# EAGLE design kitt (EAGLE 5.02)
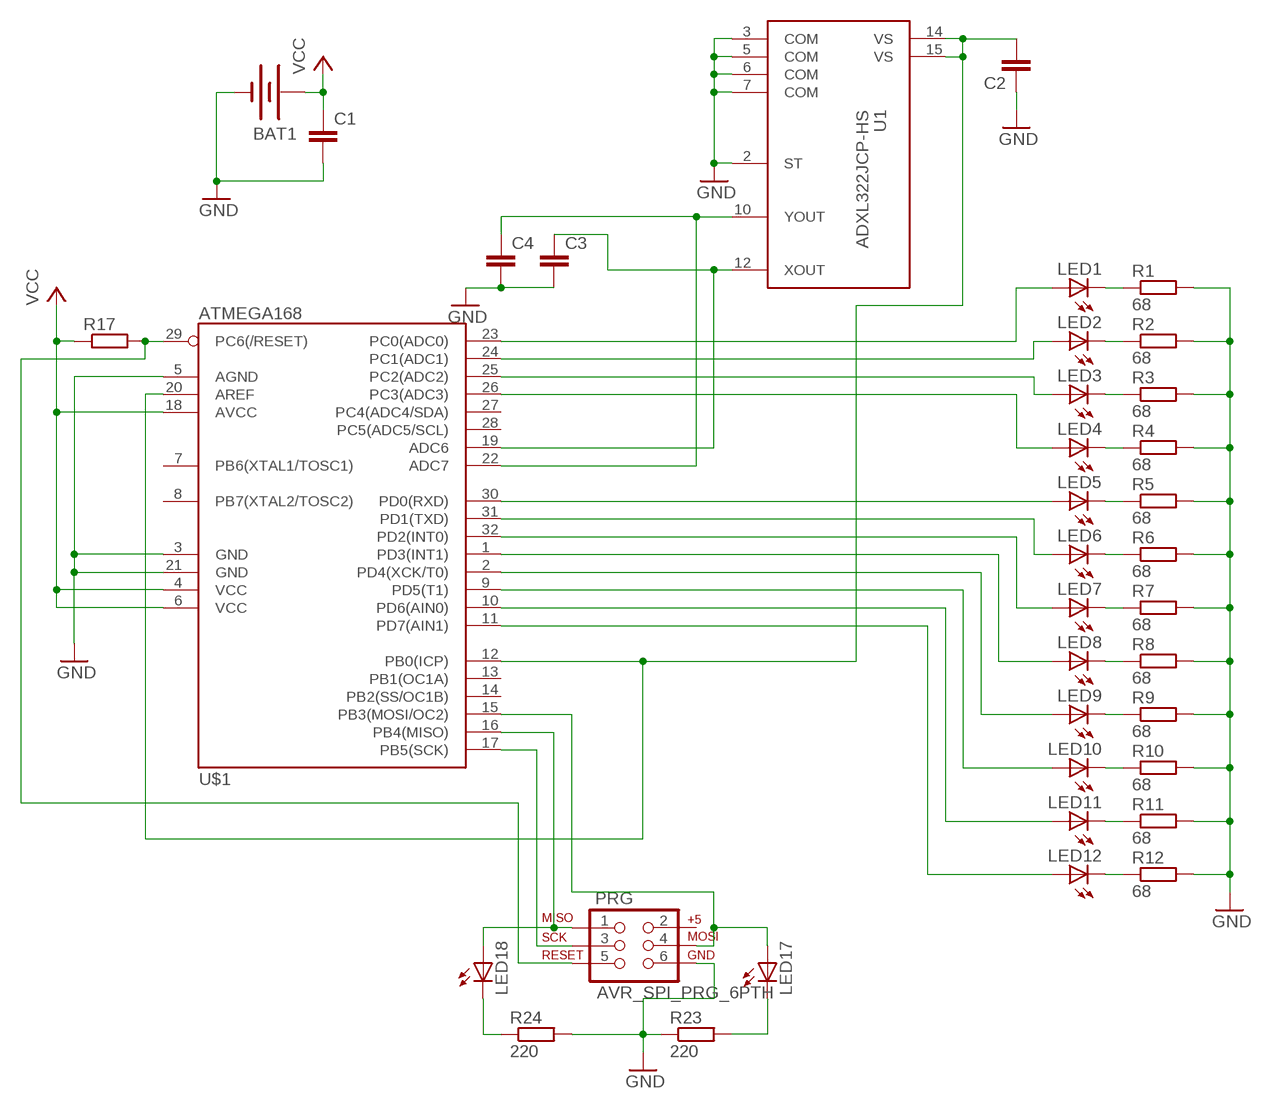
[diagram p0: schematic, sheet 1]

## Parts
BAT1  BATTERY20PTH  [BATTCOM_20MM_PTH]
C1  C-EUC0805  [C0805]
C2  C-EUC0805  [C0805]
C3  C-EUC0805  [C0805]
C4  C-EUC0805  [C0805]
LED1  LEDMICRO-SIDELED  [MICRO-SIDELED]
LED2  LEDMICRO-SIDELED  [MICRO-SIDELED]
LED3  LEDMICRO-SIDELED  [MICRO-SIDELED]
LED4  LEDMICRO-SIDELED  [MICRO-SIDELED]
LED5  LEDMICRO-SIDELED  [MICRO-SIDELED]
LED6  LEDMICRO-SIDELED  [MICRO-SIDELED]
LED7  LEDMICRO-SIDELED  [MICRO-SIDELED]
LED8  LEDMICRO-SIDELED  [MICRO-SIDELED]
LED9  LEDMICRO-SIDELED  [MICRO-SIDELED]
LED10  LEDMICRO-SIDELED  [MICRO-SIDELED]
LED11  LEDMICRO-SIDELED  [MICRO-SIDELED]
LED12  LEDMICRO-SIDELED  [MICRO-SIDELED]
LED17  LEDCHIP-LED0805  [CHIP-LED0805]
LED18  LEDCHIP-LED0805  [CHIP-LED0805]
PRG  AVR_SPI_PRG_6PTH  [2X3]
R1  68  R-EU_M0805  [M0805]
R2  68  R-EU_M0805  [M0805]
R3  68  R-EU_M0805  [M0805]
R4  68  R-EU_M0805  [M0805]
R5  68  R-EU_M0805  [M0805]
R6  68  R-EU_M0805  [M0805]
R7  68  R-EU_M0805  [M0805]
R8  68  R-EU_M0805  [M0805]
R9  68  R-EU_M0805  [M0805]
R10  68  R-EU_M0805  [M0805]
R11  68  R-EU_M0805  [M0805]
R12  68  R-EU_M0805  [M0805]
R17  R-EU_M0805  [M0805]
R23  220  R-EU_M0805  [M0805]
R24  220  R-EU_M0805  [M0805]
U1  ADXL322JCP-HS  [LFCSP16-HS]
U$1  ATMEGA168  [TQFP32-08]

## Nets
GND: BAT1.2(-) C1.2 C2.1 C3.2 C4.2 PRG.6 R1.2 R2.2 R3.2 R4.2 R5.2 R6.2 R7.2 R8.2 R9.2 R10.2 R11.2 R12.2 R23.1 R24.2 U1.2(ST) U1.3(COM) U1.5(COM) U1.6(COM) U1.7(COM) U$1.3(GND) U$1.5(AGND) U$1.21(GND)
N$1: LED5.A U$1.30(PD0(RXD))
N$2: LED1.C R1.1
N$3: LED2.A U$1.24(PC1(ADC1))
N$4: LED3.A U$1.25(PC2(ADC2))
N$5: LED1.A U$1.23(PC0(ADC0))
N$6: LED4.A U$1.26(PC3(ADC3))
N$7: LED6.A U$1.31(PD1(TXD))
N$8: LED7.A U$1.32(PD2(INT0))
N$9: LED8.A U$1.1(PD3(INT1))
N$10: LED9.A U$1.2(PD4(XCK/T0))
N$11: LED10.A U$1.9(PD5(T1))
N$12: LED11.A U$1.10(PD6(AIN0))
N$13: LED12.A U$1.11(PD7(AIN1))
N$14: C3.1 U1.12(XOUT) U$1.19(ADC6)
N$15: C4.1 U1.10(YOUT) U$1.22(ADC7)
N$17: C2.2 U1.14(VS) U1.15(VS) U$1.12(PB0(ICP)) U$1.20(AREF)
N$18: LED2.C R2.1
N$19: LED3.C R3.1
N$20: LED4.C R4.1
N$25: LED5.C R5.1
N$26: LED6.C R6.1
N$27: LED7.C R7.1
N$28: LED8.C R8.1
N$29: LED9.C R9.1
N$30: LED10.C R10.1
N$31: LED11.C R11.1
N$32: LED12.C R12.1
N$37: PRG.5 R17.2 U$1.29(PC6(/RESET))
N$45: LED18.A PRG.1 U$1.16(PB4(MISO))
N$46: PRG.3 U$1.17(PB5(SCK))
N$47: LED17.A PRG.4 U$1.15(PB3(MOSI/OC2))
N$48: LED18.C R24.1
N$51: LED17.C R23.2
VCC: BAT1.1(+) C1.1 R17.1 U$1.4(VCC) U$1.6(VCC) U$1.18(AVCC)
Unconnected: PRG.2 U1.1(NC) U1.4(NC) U1.8(NC) U1.9(NC) U1.11(NC) U1.13(NC) U1.16(NC) U$1.7(PB6(XTAL1/TOSC1)) U$1.8(PB7(XTAL2/TOSC2)) U$1.13(PB1(OC1A)) U$1.14(PB2(SS/OC1B)) U$1.27(PC4(ADC4/SDA)) U$1.28(PC5(ADC5/SCL))

## Library data of the parts
BAT1 = SparkFun:BATTERY: Battery Holders Various common sizes : AA, AAA, 20mm coin cell and 12mm coin cell.
C1-C4 = rcl:C-EU: CAPACITOR, European symbol
LED1-LED12 LED17 LED18 = led:LED: LED OSRAM: - CHIPLED LG R971, LG N971, LY N971, LG Q971, LY Q971, LO R971, LY R971 LH N974, LH R974 LS Q976, LO Q976, LY Q976 LO Q996 - Hyper CHIPLED LW Q18S LB Q993, LB Q99A, LB R99A - SideLED LS A670, LO A670, LY A670, LG A670, LP A670 LB A673, LV A673, LT A673, LW A673 LH A674 LY A675 LS A676, LA A676, LO A676, LY A676, LW A676 LS A679, LY A679, LG A679 - Hyper Micro SIDELED® LS Y876, LA Y876, LO Y876, LY Y876 LT Y87S - SmartLED LW L88C, LW L88S LB L89C, LB L89S, LG L890 LS L89K, LO L89K, LY L89K LS L896, LA L896, LO L896, LY L896 - TOPLED LS T670, LO T670, LY T670, LG T670, LP T670 LSG T670, LSP T670, LSY T670, LOP T670, LYG T670 LG T671, LOG T671, LSG T671 LB T673, LV T673, LT T673, LW T673 LH T674 LS T676, LA T676, LO T676, LY T676, LB T676, LH T676, LSB T676, LW T676 LB T67C, LV T67C, LT T67C, LS T67K, LO T67K, LY T67K, LW E67C LS E67B, LA E67B, LO E67B, LY E67B, LB E67C, LV E67C, LT E67C LW T67C LS T679, LY T679, LG T679 LS T770, LO T770, LY T770, LG T770, LP T770 LB T773, LV T773, LT T773, LW T773 LH T774 LS E675, LA E675, LY E675, LS T675 LS T776, LA T776, LO T776, LY T776, LB T776 LHGB T686 LT T68C, LB T68C - Hyper Mini TOPLED® LB M676 - Mini TOPLED Santana® LG M470 LS M47K, LO M47K, LY M47K Source: http://www.osram.convergy.de - LUMILED® LXK2-PW12-R00, LXK2-PW12-S00, LXK2-PW14-U00, LXK2-PW14-V00 LXK2-PM12-R00, LXK2-PM12-S00, LXK2-PM14-U00 LXK2-PE12-Q00, LXK2-PE12-R00, LXK2-PE12-S00, LXK2-PE14-T00, LXK2-PE14-U00 LXK2-PB12-K00, LXK2-PB12-L00, LXK2-PB12-M00, LXK2-PB14-N00, LXK2-PB14-P00, LXK2-PB14-Q00 LXK2-PR12-L00, LXK2-PR12-M00, LXK2-PR14-Q00, LXK2-PR14-R00 LXK2-PD12-Q00, LXK2-PD12-R00, LXK2-PD12-S00 LXK2-PH12-R00, LXK2-PH12-S00 LXK2-PL12-P00, LXK2-PL12-Q00, LXK2-PL12-R00 Source: www.luxeon.com
PRG = SparkFun:AVR_SPI_PRG_6: AVR ISP 6 Pin This is the reduced ISP connector for AVR programming. Common on Arduino. This footprint will take up less PCB space and can be used with a 10-pin to 6-pin adapter such as SKU: BOB-08508
R1-R12 R17 R23 R24 = rcl:R-EU_: RESISTOR, European symbol
U1 = adxl:ADXL322
U$1 = SparkFun:ATMEGA168

## Board
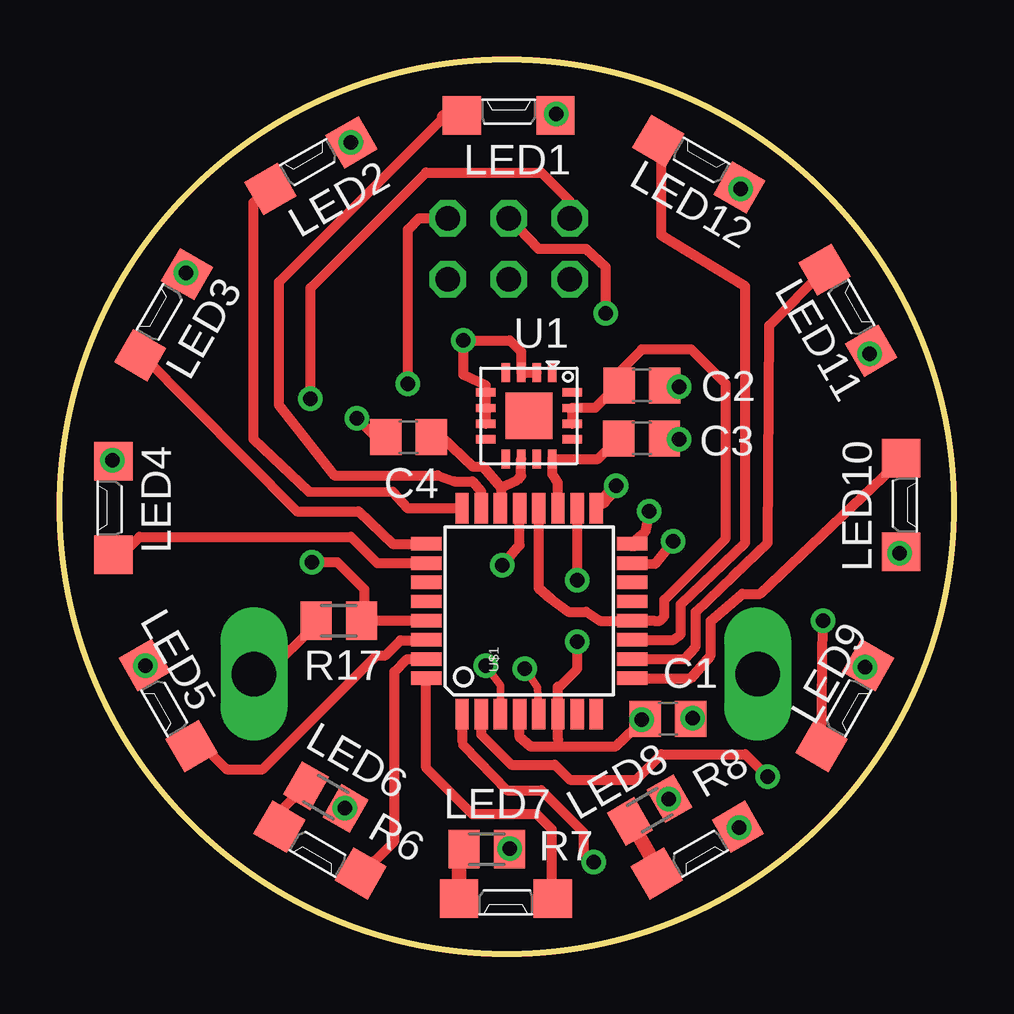
[diagram p1: board, top side]
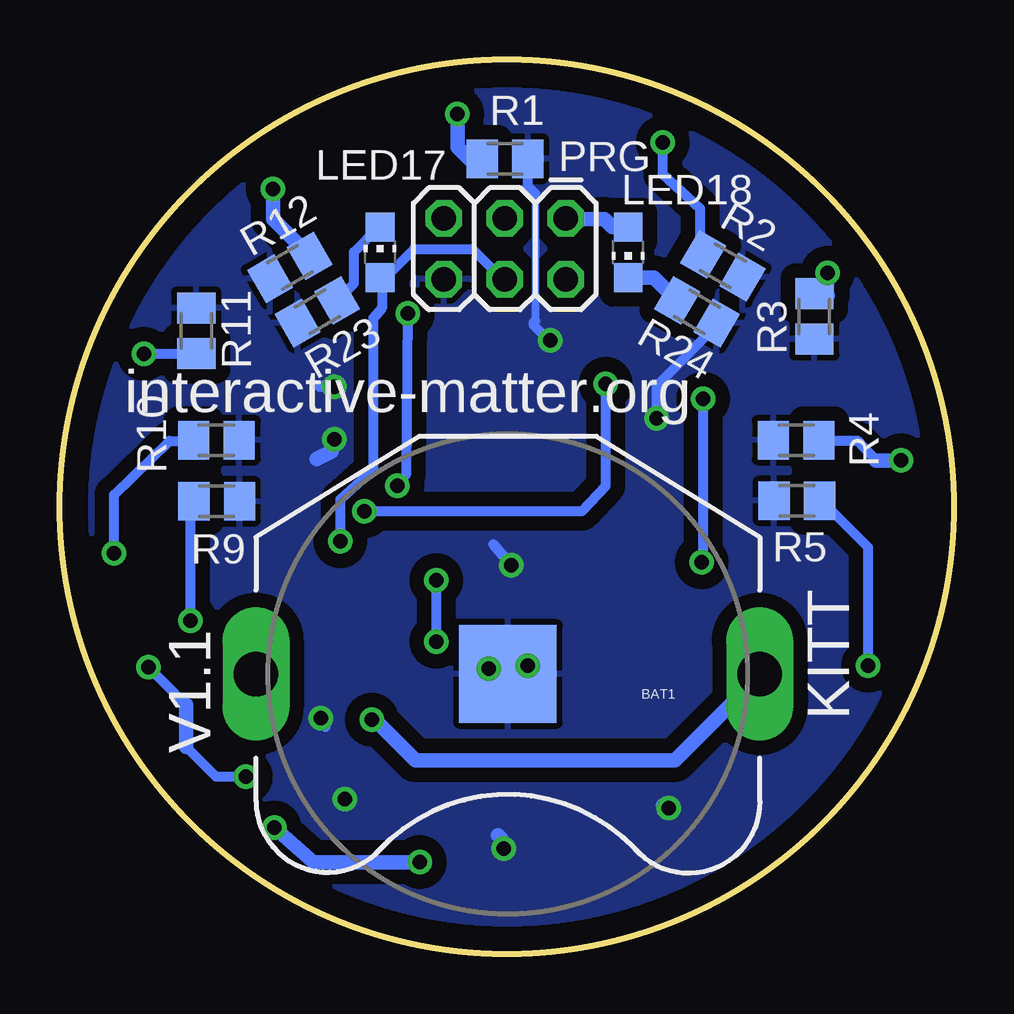
[diagram p2: board, bottom side, seen from below]

Size 37.25 x 37.25 mm. Coordinates in mm from the lower left corner, seen from the top.
Outline: circle at 18.63,18.63 radius 18.63
Copper layers (1*16): Top 0.035mm / dielectric 1.5mm / Bottom 0.035mm
Design rules "default *": minimum track width 10mil, minimum drill 20mil, track to track 8mil, track to pad 8mil, pad to pad 8mil, via to via 8mil, smd to smd 8mil, copper to edge 40mil, drill to drill 8mil, minimum pad ring 10mil, minimum via ring 8mil, stop-mask expansion 4mil, vias tented up to drill 0mil, thermal gap 10mil

### Footprints (pad centres in the part's own frame; a part is rotated, then mirrored left to right if it is on the bottom)
BATTCOM_20MM_PTH = drill 1.854 long: 1 -10.5,0; 3 10.5,0 | smd 4.064 x 4.064: 2 0,0
C0805 = smd 1.3 x 1.5: 1 -0.95,0; 2 0.95,0
MICRO-SIDELED = smd 1.6 x 1.6: A 0,1.95; C 0,-1.95
CHIP-LED0805 = smd 1.2 x 1.2: A 0,-1.05; C 0,1.05
2X3 = drill 1.016 octagon: 1 0,0; 2 0,2.54; 3 2.54,0; 4 2.54,2.54; 5 5.08,0; 6 5.08,2.54
M0805 = smd 1.3 x 1.6: 1 -0.95,0; 2 0.95,0
LFCSP16-HS = smd 0.8 x 0.35: 1 -1.8,0.975; 2 -1.8,0.325; 3 -1.8,-0.325; 4 -1.8,-0.975; 9 1.8,-0.975; 10 1.8,-0.325; 11 1.8,0.325; 12 1.8,0.975 | smd 0.35 x 0.8: 5 -0.975,-1.8; 6 -0.325,-1.8; 7 0.325,-1.8; 8 0.975,-1.8; 13 0.975,1.8; 14 0.325,1.8; 15 -0.325,1.8; 16 -0.975,1.8 | smd 1.95 x 1.95: PAD 0,0
TQFP32-08 = smd 1.27 x 0.559: 1 -4.293,2.8; 2 -4.293,2; 3 -4.293,1.2; 4 -4.293,0.4; 5 -4.293,-0.4; 6 -4.293,-1.2; 7 -4.293,-2; 8 -4.293,-2.8; 17 4.293,-2.8; 18 4.293,-2; 19 4.293,-1.2; 20 4.293,-0.4; 21 4.293,0.4; 22 4.293,1.2; 23 4.293,2; 24 4.293,2.8 | smd 0.559 x 1.27: 9 -2.8,-4.293; 10 -2,-4.293; 11 -1.2,-4.293; 12 -0.4,-4.293; 13 0.4,-4.293; 14 1.2,-4.293; 15 2,-4.293; 16 2.8,-4.293; 25 2.8,4.293; 26 2,4.293; 27 1.2,4.293; 28 0.4,4.293; 29 -0.4,4.293; 30 -1.2,4.293; 31 -2,4.293; 32 -2.8,4.293

### Placement (x,y rotation side)
BAT1  18.58,11.66 180 bottom
C1  25.34,9.79 0 top
C2  24.26,23.69 180 top
C3  24.24,21.48 0 top
C4  14.53,21.53 180 top
LED1  18.71,34.94 90 top
LED2  10.46,32.84 120 top
LED3  4.32,26.64 150 top
LED4  2.23,18.58 180 top
LED5  4.51,10.34 210 top
LED6  10.84,4.32 240 top
LED7  18.58,2.29 270 top
LED8  26.57,4.32 300 top
LED9  32.72,10.34 330 top
LED10  35.06,18.71 0 top
LED11  32.84,26.83 30 top
LED12  26.63,32.91 60 top
LED17  23.91,29.23 0 bottom
LED18  13.57,29.23 180 bottom
PRG  16.17,30.66 180 bottom
R1  18.7,33.13 0 bottom
R2  9.62,28.67 330 bottom
R3  5.81,26.56 270 bottom
R4  6.56,21.41 180 bottom
R5  6.53,18.88 180 bottom
R6  11.08,6.52 330 top
R7  17.79,4.36 0 top
R8  24.58,5.98 30 top
R9  30.72,18.86 0 bottom
R10  30.73,21.41 0 bottom
R11  31.57,25.96 90 bottom
R12  27.67,28.61 210 bottom
R17  11.63,13.88 0 top
R23  26.53,26.76 30 bottom
R24  10.7,26.76 330 bottom
U1  19.55,22.42 270 top
U$1  19.56,14.28 90 top

### Tracks (layer width: path | path; a pad name or v marks a point on that pad's centre or on a via)
GND  (via drill 0.6)
  Top 0.305: U$1.3 18.36,11.17 v17.75,12 | U$1.5 19.9,11.1 v19.38,11.88
  Top 0.406: U$1.21 19.16,17.03 v18.44,16.19 | C4.2 13.17,21.52 v12.38,22.31 | U1.7 17.75,22.63 17.69,22.69 17.74,22.74 U1.6 17.75,23.31 17.69,23.38 17.71,23.39 U1.5 17.75,23.69 16.81,24.13 v16.81,25.56 18.75,25.56 19.23,25.09 U1.3 19.35,24.22 19.38,24.19 19.41,24.22 U1.2 | C1.2 26.35,9.79 v26.38,9.81 | C2.1 25.5,23.69 v25.81,23.63
  Top 0.61: R7.2 18.62,4.24 v18.75,4.38 | C3.2 25.2,21.32 v25.81,21.44 | R6.2 11.92,6.05 v11.88,6.06 | R8.2 25.4,6.53 v25.38,6.44
  Bottom 0.305: 17.44,26.38 17.44,31.69
  Bottom 0.406: v18.44,16.19 19.19,17.06 | R24.2 9.88,26.18 12.38,23.69 v12.38,22.31 | R1.2 17.75,32 17.44,31.69 | 17.44,26.38 17.5,26.31 17.5,26.19 16.88,25.56 v16.81,25.56 | v26.38,9.81 26.38,9.63 26.19,9.44 | v25.81,23.63 26.44,23.63 26.25,23.69
  Bottom 0.61: BAT1.2 18.5,11.56 v17.75,12 | v19.38,11.88 19.94,11.69 19.19,12.75 | v18.75,4.38 18.88,4.81 19,4.94 | v16.81,25.56 16.94,25.38 | v25.81,21.44 25.94,20.94 26.56,20.63 | v11.88,6.06 11.94,6.13 12.13,6.19 | v25.38,6.44 25.5,6.31
  pour Bottom (isolate 0.61): -0.5,37.88 37.57,37.88 37.57,-0.13 -0.43,-0.19 -0.43,35.51
N$1
  Top 0.406: 6.04,8.59 6.94,7.69 8.44,7.69 13.19,12.44 13.56,12.44 14.19,13.06 15.19,13.06 15.21,13.08 U$1.30
  Top 0.61: LED5.A 6.04,8.59
N$2  (via drill 0.6)
  Top 0.61: LED1.C 20.66,35.03 v20.69,35
  Bottom 0.61: v20.69,35 20.69,33.63 20.19,33.13 19.75,33.13 19.74,33.13 R1.1
N$3
  Top 0.406: U$1.24 14.49,18.57 13.88,19.25 10.37,19.26 8.06,21.44 8.06,31.31 8.71,31.96
  Top 0.61: 8.75,32 8.71,31.96 LED2.A
N$4
  Top 0.406: U$1.25 13.86,17.08 12.44,18.44 9.88,18.44 3.37,25.01
  Top 0.61: LED3.A 3.37,25.01
N$5
  Top 0.406: U$1.23 17.56,19.25 17.19,19.69 16.44,19.69 15.75,19.94 11.44,19.94 9.13,22.88 9.13,28 16,34.88
  Top 0.61: 16,34.88 LED1.A
N$6
  Top 0.406: U$1.26 13.22,16.28 12.13,17.38 3.31,17.38 2.25,16.31
  Top 0.61: 2.25,16.31 2.16,16.4 LED4.A
N$7
  Top 0.406: U$1.31 14.47,12.28 13.94,11.75 13.94,4.69 12.47,3.22
  Top 0.61: LED6.A 12.47,3.22
N$8
  Top 0.406: U$1.32 15.27,7.73 17.19,5.81 19.88,5.81 20.5,5.19 20.5,2.38
  Top 0.61: LED7.A 20.47,2.16 20.38,2.25 20.5,2.38
N$9  (via drill 0.6)
  Top 0.305: 16.76,8.89 16.75,9.19 16.81,8.69
  Top 0.406: U$1.1 16.76,8.89 | 16.81,8.69 18.63,6.81 20.06,6.81 21.81,5.06 21.81,4.25 v22.25,3.81
  Top 0.61: 28.29,5.23 28.25,5.19 | 28.29,5.23 LED8.A | v28.31,5.25 28.29,5.23
  Bottom 0.61: v22.25,3.81 26.69,3.81 v28.31,5.25
N$10  (via drill 0.6)
  Top 0.406: U$1.2 17.56,9.13 18.81,7.88 20.63,7.88 21.25,7.25 24,7.25 25.06,8.31 28.56,8.31 v29.5,7.38
  Top 0.61: 33.84,11.97 33.88,12 | 33.84,11.97 LED9.A | v33.56,11.94 33.81,11.94 33.84,11.97
  Bottom 0.406: v29.5,7.38 30.75,7.38 32,8.63 | 32,10.38 v33.56,11.94
  Bottom 0.61: 32,8.63 32,10.38
N$11
  Top 0.406: U$1.9 26.29,11.48 27.13,12.44 27.13,13.88 28.44,15 29.19,15 35.16,20.66
  Top 0.61: 35.19,20.69 35.16,20.66 LED10.A
N$12
  Top 0.406: U$1.10 26.03,12.28 26.5,12.81 26.5,14.25 28.06,15.75 29.5,17.13 29.56,26.19 31.87,28.49
  Top 0.61: 31.87,28.49 LED11.A
N$13
  Top 0.406: U$1.11 25.58,13.08 25.88,13.31 25.88,14.56 28.56,17.13 28.56,27.81 25.06,29.94 25.06,33.75
  Top 0.61: LED12.A 25.01,33.94 LED12.A 25.06,33.75
N$14
  Top 0.406: C3.1 22.43,20.62 U1.12 20.53,19.98 20.75,19.63 20.75,18.94 20.81,18.88 20.76,18.82 U$1.19
N$15
  Top 0.406: 18.38,19.44 19.06,19.75 19.23,19.91 U1.10 | U$1.22 18.36,18.61 18.38,18.63 18.38,19.44 | C4.1 15.92,21.52 17.19,20.31 17.63,20.31 18.38,19.44
N$17
  Top 0.406: U1.14 21.35,22.65 21.31,22.69 21.35,22.73 U1.15 22.31,22.74 23.25,23.69 C2.2 23.31,24.13 23.25,24.19 24.25,25.19 26.31,25.19 27.75,23.75 27.75,17.31 25.19,14.75 25.19,14.06 25,13.88 24.75,13.88 U$1.12 23.7,13.88 23.69,13.88 22.5,13.88 21.94,14.25 21.19,14.25 20.48,14.79 19.96,15.23 U$1.20
N$18  (via drill 0.6)
  Top 0.61: LED2.C 12.09,33.9 v12.13,33.81
  Bottom 0.406: v12.13,33.81 12.13,32.5 10.56,31.06 10.56,29.25
  Bottom 0.61: R2.1 10.46,29.15 10.56,29.25
N$19  (via drill 0.6)
  Top 0.61: LED3.C 5.24,28.39 v5.25,28.38
  Bottom 0.61: R3.1 5.3,27.43 5.25,27.44 5.31,27.44 v5.25,28.38
N$20  (via drill 0.6)
  Top 0.61: LED4.C 2.16,20.6 v2.19,20.56
  Bottom 0.406: 3.25,20.56 4,21.38 5.5,21.38
  Bottom 0.61: v2.19,20.56 3.25,20.56 | 5.5,21.38 5.53,21.41 R4.1
N$25  (via drill 0.6)
  Top 0.61: LED5.C 3.47,12.16 v3.56,12
  Bottom 0.406: v3.56,12 3.56,16.94 5.56,18.94
  Bottom 0.61: 5.56,18.94 5.58,18.92 R5.1
N$26
  Top 0.406: 9.09,5.84 10.25,7
  Top 0.61: 10.25,7 R6.1 | LED6.C 9.09,5.84
N$27
  Top 0.61: R7.1 16.73,4.36 16.63,4.26 LED7.C
N$28
  Top 0.61: LED8.C 24.95,3.32 25,3.38 24.26,4.68 R8.1
N$29  (via drill 0.6)
  Top 0.406: LED9.C v31.81,13.87
  Top 0.61: v31.81,13.87 v31.81,13.88
  Bottom 0.406: v31.81,13.88 31.81,18.56
  Bottom 0.61: R9.1 31.67,18.79 31.63,18.75 31.81,18.56
N$30  (via drill 0.6)
  Top 0.61: LED10.C 35.06,16.63 v35,16.69
  Bottom 0.406: v35,16.69 35,19.13 32.69,21.38 31.69,21.38
  Bottom 0.61: 31.66,21.41 31.63,21.44 | 31.66,21.41 R10.1 | 31.69,21.38 31.66,21.41
N$31  (via drill 0.6)
  Top 0.61: LED11.C 33.82,25.01 v33.75,25
  Bottom 0.406: 31.63,25 v33.75,25
  Bottom 0.61: 31.63,25 31.68,25.07 R11.1
N$32  (via drill 0.6)
  Top 0.61: LED12.C 28.39,31.88 v28.38,31.88
  Bottom 0.61: R12.1 26.75,29 | R12.1 | v28.38,31.88 28.38,30.63 R12.1
N$37  (via drill 0.6)
  Top 0.406: 12.63,13.88 U$1.29 | PRG.5 21.25,31.38 20.06,32.56 15.25,32.56 10.44,27.75 v10.44,23.13 | v10.5,16.31 11.56,16.31 12.69,15.19 12.69,13.94
  Top 0.61: 12.63,13.88 R17.2 12.63,13.88 12.69,13.94
  Bottom 0.406: 10.44,16.38 v10.44,23.13
  Bottom 0.61: v10.5,16.31 10.44,16.38
N$45  (via drill 0.6)
  Top 0.406: PRG.1 14.97,30.66 14.5,30.19 v14.5,23.75 | 23.92,17.08 23.94,17.06 | 24.3,17.08 U$1.16 24,17.08 | v24.56,18.44 24.38,17.56 24,17.25 24,17.08 | 24,17.08 24,17.06
  Top 0.61: U$1.16 23.92,17.08
  Bottom 0.406: v24.56,18.44 15.5,18.44 14.5,19.5 v14.5,23.75
  Bottom 0.61: LED18.A 14.22,30.28 14.56,30.63 16.13,30.63 16.16,30.66 PRG.1
N$46  (via drill 0.6)
  Top 0.406: 18.72,30.66 19.94,29.38 21.94,29.38 22.75,28.63 v22.75,26.69 | U$1.17 22.36,18.74
  Top 0.61: 18.72,30.66 PRG.3 | v23.19,19.5 22.63,18.88 22.36,18.74
  Bottom 0.406: v22.75,26.69 22.81,20 v23.19,19.5
N$47  (via drill 0.6)
  Top 0.406: U$1.15 23.91,16.28 24.81,16.25 v25.56,17.19
  Bottom 0.406: 18.8,28.11 20.06,29.38 22.5,29.38 23.81,28.06 23.81,26.94 24.19,26.5 24.19,20.19 25.56,18.94 v25.56,17.19
  Bottom 0.61: 18.8,28.11 PRG.4 | 23.81,28.06 23.91,28.16 LED17.A
N$48
  Bottom 0.61: R24.1 11.54,27.23 12.5,28.18 LED18.C
N$51
  Bottom 0.406: LED17.C 23.97,30.28 25,29.25 25,27.94 R23.2
VCC  (via drill 0.6)
  Top 0.305: 24.38,9.81 C1.1 | 20.75,8.63 20.76,8.93
  Top 0.406: BAT1.1 8.6,11.66 10.75,13.81 | 20.76,10.01 U$1.6 | U$1.4 19.16,9.03 19.63,8.63 20.75,8.63 23.13,8.63 24.38,9.81 | 20.76,8.93 20.76,10.01 | 20.76,10.01 20.76,11.12 20.75,11.13 20.81,11.13 21.56,11.88 v21.56,13 | U$1.18 21.56,18.44 v21.56,15.56
  Top 0.61: 10.75,13.81 10.69,13.88 R17.1 | C1.1 24.25,9.79 v24.25,9.75
  Bottom 0.406: v21.56,13 v21.56,15.56
  Bottom 0.61: v24.25,9.75 24.19,9.75 24.19,9.81 | 24.19,9.81 24.19,9.88 | 24.19,9.81 22.44,8.06 11.63,8.06 8.08,11.61 BAT1.1

### Text on the board
bNames: interactive-matter.org | KITT | V1.1